# Altium schematic sheet PSU_MAX1831_1V0_ALT.SchDoc: Power Supply MAX1831 (1V0)
size A4; Organization: Altium Limited.; Address1: Level 3, 12a Rodborough Rd; Address2: Frenchs Forest 2086; Address3: NSW; Address4: AUSTRALIA; SheetNumber: 1; SheetTotal: 100; PageSetup: Record=PageOptions|CenterHorizontal=True|CenterVertical=True|PrintScale=0.97|XCorrection=1.00|YCorrection=1.00|PrintKind=1|BorderSize=5000000|LeftOffset=0|BottomOffset=0|Orientation=2|PaperLength=1000|PaperWidth=1000|Scale=100|PaperSource=7|PrintQuality=-4|MediaType=1|DitherType=10|PaperKind=A4 (210 x 297 mm)|PrintScaleMode=1
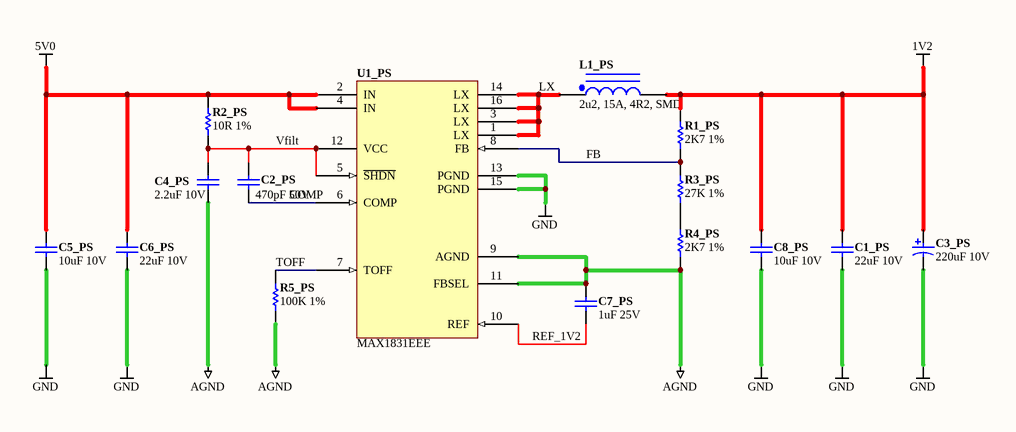
[diagram p0: PSU_MAX1831_1V0_ALT.SchDoc]

## Parts
C1_PS  22uF 10V  [CAPC3225-STAR]
C2_PS  470pF 50V  [CAPC1005-STAR]
C3_PS  220uF 10V  [CAPC7343-STAR]
C4_PS  2.2uF 10V  [CAPC1608-STAR]
C5_PS  10uF 10V  [CAPC2012-STAR]
C6_PS  22uF 10V  [CAPC3225-STAR]
C7_PS  1uF 25V  [CAPC3216-STAR]
C8_PS  10uF 10V  [CAPC2012-STAR]
L1_PS  2u2, 15A, 4R2, SMD  [IND-EPCOS-SMD-B82559]
R1_PS  2K7 1%  [RESC1005-STAR]
R2_PS  10R 1%  [RESC1005-STAR]
R3_PS  27K 1%  [RESC1005-STAR]
R4_PS  2K7 1%  [RESC1005-STAR]
R5_PS  100K 1%  [RESC1005-STAR]
U1_PS  MAX1831EEE  [SOP63P602-16]

## Nets
1V2: C1_PS.1 C3_PS.1 C8_PS.1 L1_PS.2 R1_PS.1
5V0: C5_PS.1 C6_PS.1 R2_PS.1 U1_PS.2(IN) U1_PS.4(IN)
AGND: C4_PS.2 C7_PS.1 R4_PS.2 R5_PS.2 U1_PS.9(AGND) U1_PS.11(FBSEL)
GND: C1_PS.2 C3_PS.2 C5_PS.2 C6_PS.2 C8_PS.2 U1_PS.13(PGND) U1_PS.15(PGND)
COMP: C2_PS.2 U1_PS.6(COMP)
FB: R1_PS.2 R3_PS.1 U1_PS.8(FB)
LX: L1_PS.1 U1_PS.1(LX) U1_PS.3(LX) U1_PS.14(LX) U1_PS.16(LX)
REF_1V2: C7_PS.2 U1_PS.10(REF)
TOFF: R5_PS.1 U1_PS.7(TOFF)
Vfilt: C2_PS.1 C4_PS.1 R2_PS.2 U1_PS.5(~{SHDN}) U1_PS.12(VCC)
NetR3_PS_2: R3_PS.2 R4_PS.1

## Notes on the sheet
- Sheet Title
- Project Title
- Size:
- Date:
- A4
- Assy:
- Time:
- Revision:
- Sheet
- of
- File:

## Library data of the parts
C1_PS C6_PS = D-101-0021: Capacitor, Ceramic, 22uF -20%/+80% 10V 1210 (3225) Y5V; Polarity: Non-Polarized; Tolerance: -20 / +80 %; Capacitance: 22 uF; Dielectric: Y5V; Mounting Technology: Surface Mount; Rated Voltage: 10 V; Status: Production; Technology: Ceramic; Category: Capacitor
C2_PS = D-101-0069: Capacitor, Ceramic, 470pF 5% 50V 0402 (1005) COG; Polarity: Non-Polarized; Capacitance: 470 pF; Dielectric: COG; Mounting Technology: Surface Mount; Rated Voltage: 50 V; Status: Production; Technology: Ceramic; Tolerance: 5 %; Category: Capacitor
C3_PS = D-101-0088: Capacitor, Tantalum, 220uF 10% 10V MCCT-D (7343-31); Polarity: Polarized; Capacitance: 220 uF; Mounting Technology: Surface Mount; Rated Voltage: 10 V; Status: Unreleased; Technology: Tantalum; Tolerance: 10 %; Category: Capacitor
C4_PS = D-101-0095: Capacitor, Ceramic, 2.2uF 10% 10V 0603 (1608) X5R; Polarity: Non-Polarized; Capacitance: 2.2 uF; Dielectric: X5R; Mounting Technology: Surface Mount; Rated Voltage: 10 V; Status: Unreleased; Technology: Ceramic; Tolerance: 10 %; Category: Capacitor
C5_PS C8_PS = D-101-0087: Capacitor, Ceramic, 10uF 10% 10V 0805 (2012) X5R; Polarity: Non-Polarized; Capacitance: 10 uF; Dielectric: X5R; Mounting Technology: Surface Mount; Rated Voltage: 10 V; Status: Unreleased; Technology: None; Tolerance: 10 %; Category: Capacitor
C7_PS = D-101-0027: Capacitor, Ceramic, 1uF 10% 25V 1206 (3216) X7R; Polarity: Non-Polarized; Capacitance: 1 uF; Dielectric: X7R; Mounting Technology: Surface Mount; Rated Voltage: 25 V; Status: Production; Technology: Ceramic; Tolerance: 10 %; Category: Capacitor
L1_PS = D-102-0004: Inductor, 2.2uH, 15A, 4R2, SMD; Inductance: 2.2 uH; Max Input Current: 15 A; Mounting Technology: Surface Mount; Status: Production; Category: Inductor
R1_PS R4_PS = D-100-0105: Resistor, 2K7 1% 0402 (1005); Power Rating: 63 mW; Resistance: 2.7 K; Mounting Technology: Surface Mount; Status: Production; Tolerance: 1 %; Category: Resistor
R2_PS = D-100-0128: Resistor, 10R 1% 0402 (1005); Power Rating: 63 mW; Mounting Technology: Surface Mount; Resistance: 10 R; Status: Production; Tolerance: 1 %; Category: Resistor
R3_PS = D-100-0109: Resistor, 27K 1% 0402 (1005); Power Rating: 63 mW; Mounting Technology: Surface Mount; Resistance: 27 K; Status: Production; Tolerance: 1 %; Category: Resistor
R5_PS = D-100-0132: Resistor, 100K 1% 0402 (1005); Power Rating: 63 mW; Mounting Technology: Surface Mount; Resistance: 100 K; Status: Production; Tolerance: 1 %; Category: Resistor
U1_PS = D-204-0002: MAX1831EEE, 3A, 1MHz, Low-Voltage, Step-Down Regulators with Synchronous Rectification and Internal Switches; Max Input Voltage: 5.5 V; Max Output Voltage: 5.5 mV; Min Input Voltage: 3 V; Min Output Voltage: 1.084 V; Supply Voltage: mV; Max Output Current: 3 A; Mounting Technology: Surface Mount; Status: Production; Temperature Range: -40 to +85 deg C; Category: IC-Power